# EAGLE design distortion-noise-and-ring-modulator-v1.1 (EAGLE 9.6.2)

## Sheet 1 of 3: Ring modulator
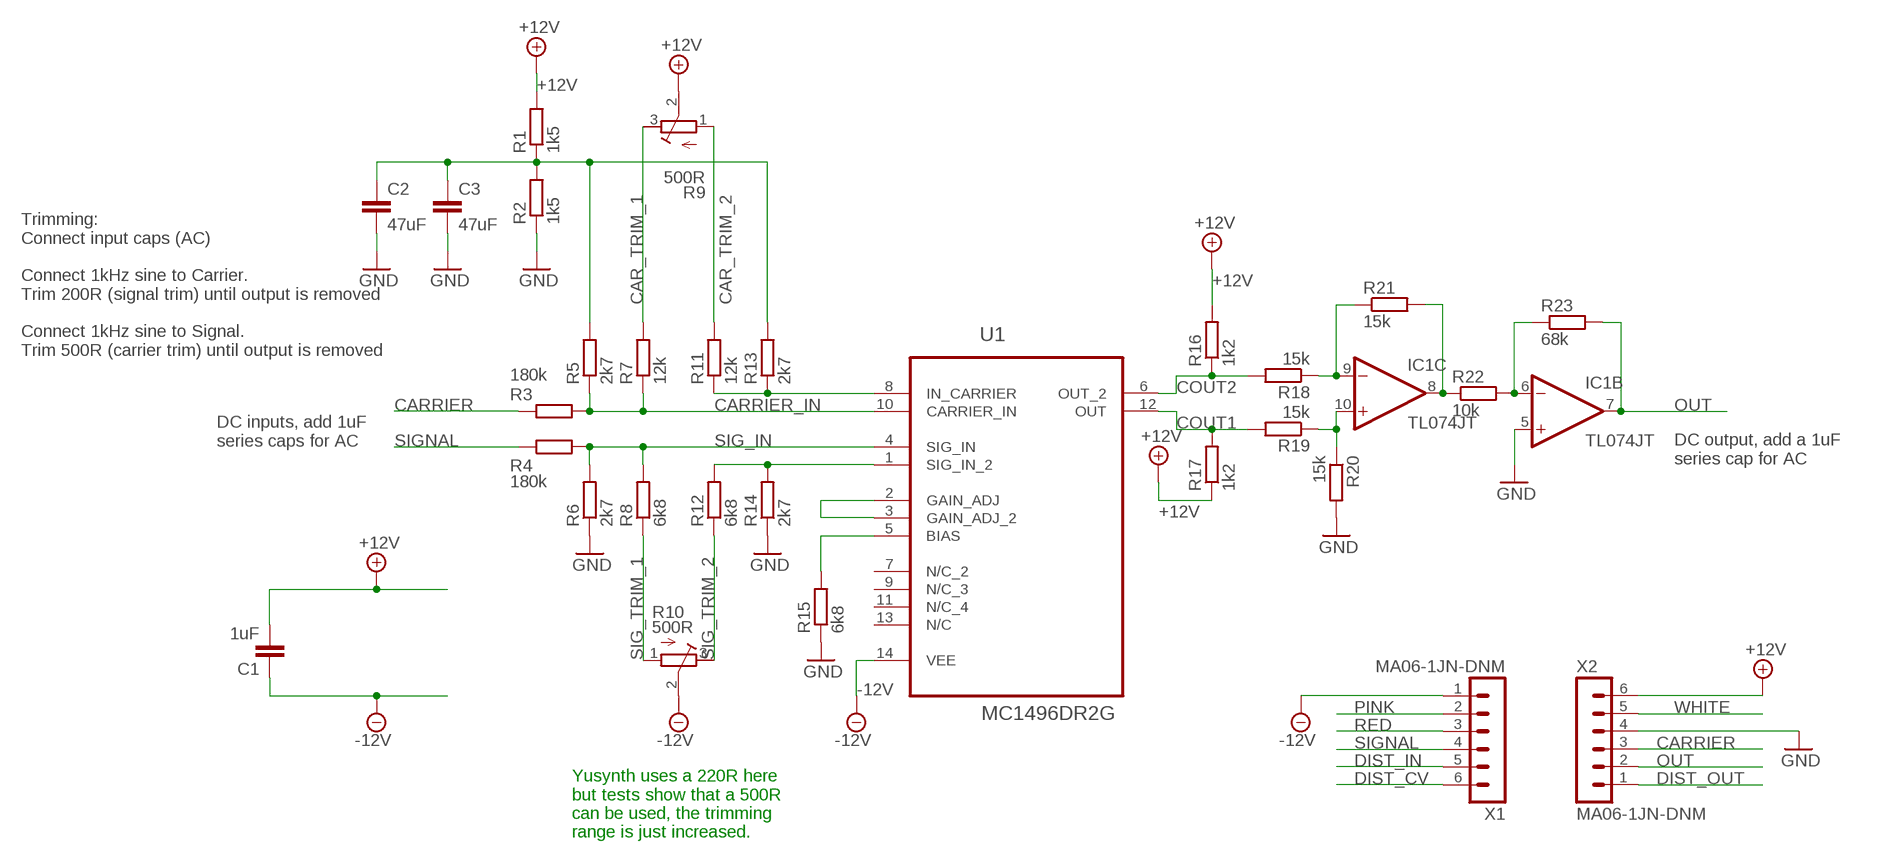
[diagram p0: schematic, sheet 1]

### Parts
C1  1uF  C-EU-J0402  [C0402-J]
C2  47uF  C-EUC1206  [C1206]
C3  47uF  C-EUC1206  [C1206]
IC1  TL074JT  [TSSOP14J]
R1  1k5  R-EU_R0402  [R0402]
R2  1k5  R-EU_R0402  [R0402]
R3  180k  R-EU_R0402  [R0402]
R4  180k  R-EU_R0402  [R0402]
R5  2k7  R-EU_R0603  [R0603]
R6  2k7  R-EU_R0603  [R0603]
R7  12k  R-EU_R0402  [R0402]
R8  6k8  R-EU_R0603  [R0603]
R9  500R  R-TRIMM3296X  [RTRIM3296X]
R10  500R  R-TRIMM3296X  [RTRIM3296X]
R11  12k  R-EU_R0402  [R0402]
R12  6k8  R-EU_R0603  [R0603]
R13  2k7  R-EU_R0603  [R0603]
R14  2k7  R-EU_R0603  [R0603]
R15  6k8  R-EU_R0603  [R0603]
R16  1k2  R-EU_R0603  [R0603]
R17  1k2  R-EU_R0603  [R0603]
R18  15k  R-EU_R0402  [R0402]
R19  15k  R-EU_R0402  [R0402]
R20  15k  R-EU_R0402  [R0402]
R21  15k  R-EU_R0402  [R0402]
R22  10k  R-EU_R0402  [R0402]
R23  68k  R-EU_R0603  [R0603]
U1  MC1496DR2G  [SOIC127P600X175-14N]
X1  MA06-1JN-DNM  MA06-1JN  [MA06N-1J]
X2  MA06-1JN-DNM  MA06-1JN  [MA06N-1J]

### Nets
+12V: C1.2 R1.2 R9.2(S) R16.2 R17.1 X2.6 ; also sheet 2,3
-12V: C1.1 R10.2(S) U1.14(VEE) X1.1 ; also sheet 2,3
CAR_TRIM_1: R7.2 R9.3(E)
CAR_TRIM_2: R9.1(A) R11.2
CARRIER: R3.1 X2.3
CARRIER_IN: R3.2 R5.1 R7.1 U1.10(CARRIER_IN)
COUT1: R17.2 R19.2 U1.12(OUT)
COUT2: R16.1 R18.2 U1.6(OUT_2)
DIST_CV: X1.6 ; also sheet 3
DIST_IN: X1.5 ; also sheet 3
DIST_OUT: X2.1 ; also sheet 3
GND: C2.2 C3.2 IC1.5(B:+IN) R2.1 R6.1 R14.1 R15.1 R20.2 X2.4 ; also sheet 2,3
N$3: R12.2 R14.2 U1.1(SIG_IN_2)
N$8: R11.1 R13.1 U1.8(IN_CARRIER)
N$9: C2.1 C3.1 R1.1 R2.2 R5.2 R13.2
N$11: R15.2 U1.5(BIAS)
N$12: U1.2(GAIN_ADJ) U1.3(GAIN_ADJ_2)
N$15: IC1.10(C:+IN) R19.1 R20.1
N$16: IC1.9(C:-IN) R18.1 R21.1
N$17: IC1.8(C:OUT) R21.2 R22.1
N$18: IC1.6(B:-IN) R22.2 R23.1
OUT: IC1.7(B:OUT) R23.2 X2.2
PINK: X1.2 ; also sheet 2
RED: X1.3 ; also sheet 2
SIG_IN: R4.2 R6.2 R8.2 U1.4(SIG_IN)
SIG_TRIM_1: R8.1 R10.1(A)
SIG_TRIM_2: R10.3(E) R12.1
SIGNAL: R4.1 X1.4
WHITE: X2.5 ; also sheet 2
Unconnected: U1.7(N/C_2) U1.9(N/C_3) U1.11(N/C_4) U1.13(N/C)

### Notes on the sheet
- Trimming:
  Connect input caps (AC)
  
  Connect 1kHz sine to Carrier. 
  Trim 200R (signal trim) until output is removed
  
  Connect 1kHz sine to Signal. 
  Trim 500R (carrier trim) until output is removed
- DC inputs, add 1uF 
  series caps for AC
- DC output, add a 1uF 
  series cap for AC
- Yusynth uses a 220R here
  but tests show that a 500R
  can be used, the trimming
  range is just increased.

## Sheet 2 of 3: Noise
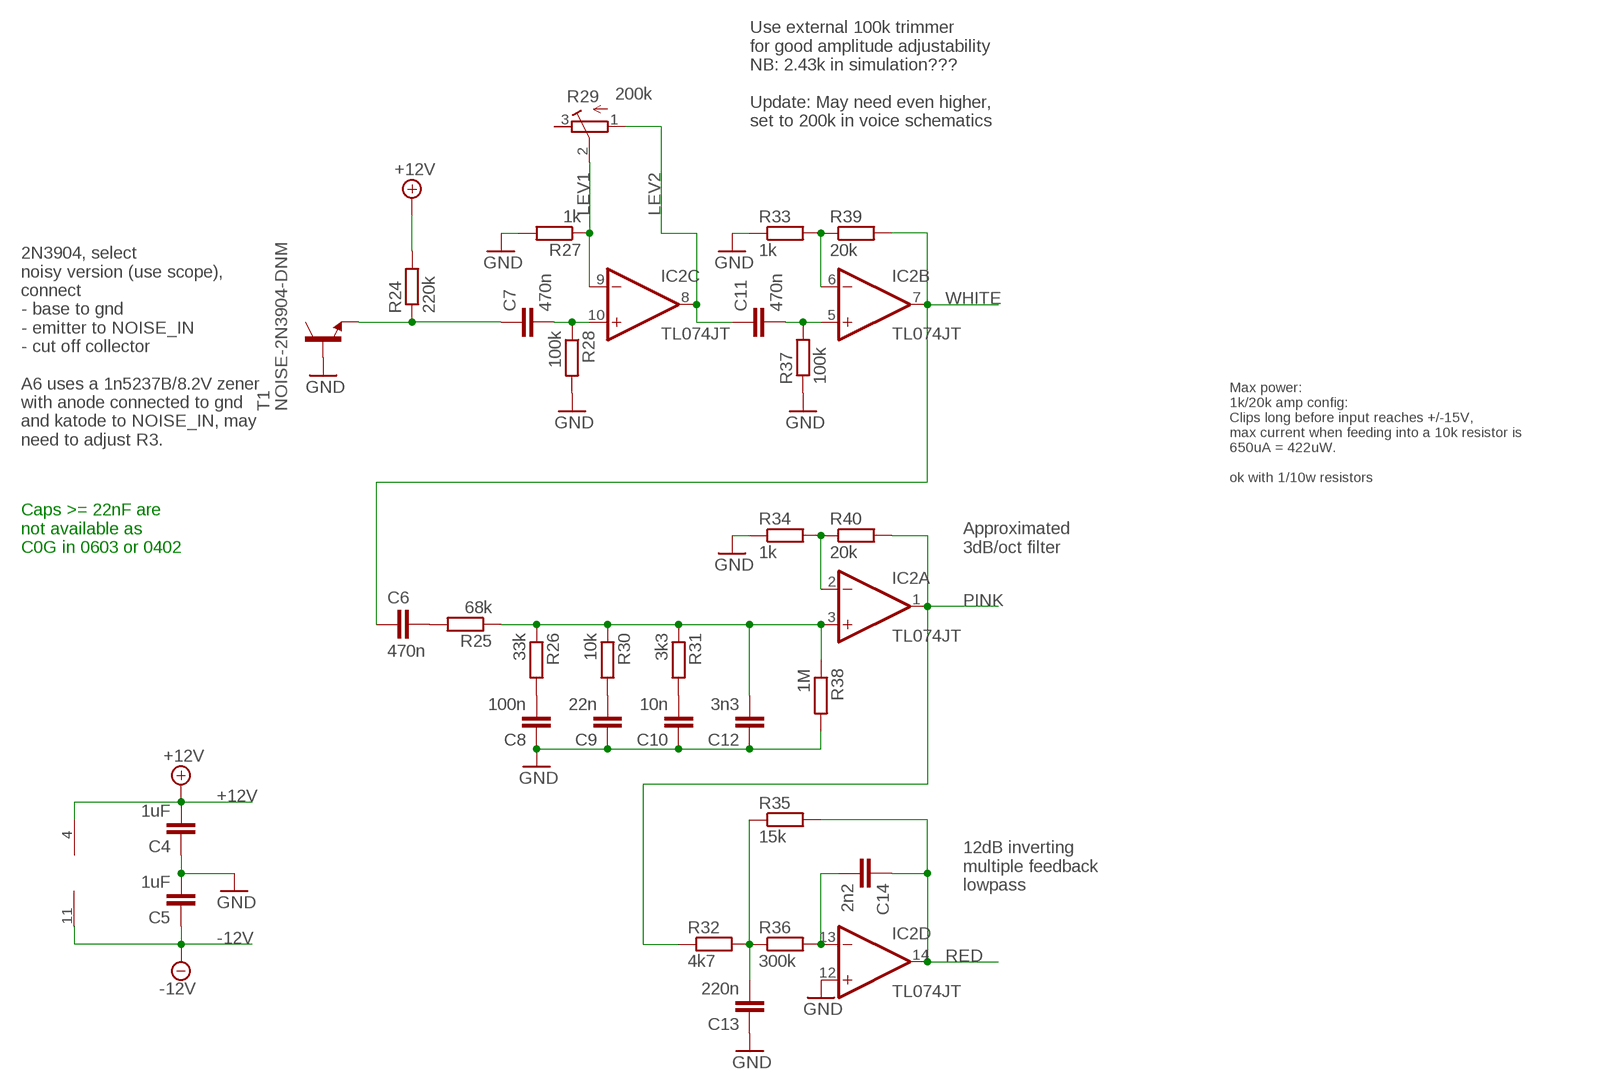
[diagram p1: schematic, sheet 2]

### Parts
C4  1uF  C-EU-J0402  [C0402-J]
C5  1uF  C-EU-J0402  [C0402-J]
C6  470n  C-EU-J0603  [C0603-J]
C7  470n  C-EU-J0603  [C0603-J]
C8  100n  C-EU-J0402  [C0402-J]
C9  22n  C-EU-J0402  [C0402-J]
C10  10n  C-EU-J0402  [C0402-J]
C11  470n  C-EU-J0603  [C0603-J]
C12  3n3  C-EU-J0603  [C0603-J]
C13  220n  C-EU-J0402  [C0402-J]
C14  2n2  C-EU-J0603  [C0603-J]
IC2  TL074JT  [TSSOP14J]
R24  220k  R-EU_R0603  [R0603]
R25  68k  R-EU_R0603  [R0603]
R26  33k  R-EU_R0402  [R0402]
R27  1k  R-EU_R0402  [R0402]
R28  100k  R-EU_R0402  [R0402]
R29  200k  R-TRIMM3296W  [RTRIM3296W]
R30  10k  R-EU_R0402  [R0402]
R31  3k3  R-EU_R0402  [R0402]
R32  4k7  R-EU_R0402  [R0402]
R33  1k  R-EU_R0402  [R0402]
R34  1k  R-EU_R0402  [R0402]
R35  15k  R-EU_R0402  [R0402]
R36  300k  R-EU_R0603  [R0603]
R37  100k  R-EU_R0402  [R0402]
R38  1M  R-EU_R0402  [R0402]
R39  20k  R-EU_R0402  [R0402]
R40  20k  R-EU_R0402  [R0402]
T1  NOISE-2N3904-DNM  NOISE-2N3904  [NOISE-2N3904-J]

### Nets
+12V: C4.2 IC2.4(P:V+) R24.2 ; also sheet 1,3
-12V: C5.1 IC2.11(P:V-) ; also sheet 1,3
GND: C4.1 C5.2 C8.1 C9.1 C10.1 C12.1 C13.1 IC2.12(D:+IN) R27.2 R28.2 R33.1 R34.1 R37.1 R38.2 T1.B ; also sheet 1,3
LEV1: IC2.9(C:-IN) R27.1 R29.2(S)
LEV2: C11.1 IC2.8(C:OUT) R29.1(A)
N$1: IC2.2(A:-IN) R34.2 R40.1
N$2: IC2.6(B:-IN) R33.2 R39.1
N$4: C8.2 R26.2
N$5: C9.2 R30.2
N$6: C10.2 R31.2
N$7: C7.1 R24.1 T1.E
N$10: C7.2 IC2.10(C:+IN) R28.1
N$13: C11.2 IC2.5(B:+IN) R37.2
N$14: C12.2 IC2.3(A:+IN) R25.1 R26.1 R30.1 R31.1 R38.1
N$19: C6.2 R25.2
N$20: C13.2 R32.2 R35.1 R36.1
N$21: C14.2 IC2.13(D:-IN) R36.2
PINK: IC2.1(A:OUT) R32.1 R40.2 ; also sheet 1
RED: C14.1 IC2.14(D:OUT) R35.2 ; also sheet 1
WHITE: C6.1 IC2.7(B:OUT) R39.2 ; also sheet 1
Unconnected: R29.3(E)

### Notes on the sheet
- Use external 100k trimmer 
  for good amplitude adjustability
  NB: 2.43k in simulation???
  
  Update: May need even higher, 
  set to 200k in voice schematics
- 2N3904, select
  noisy version (use scope),
  connect 
  - base to gnd
  - emitter to NOISE_IN
  - cut off collector
  
  A6 uses a 1n5237B/8.2V zener
  with anode connected to gnd 
  and katode to NOISE_IN, may
  need to adjust R3.
- Max power:
  1k/20k amp config:
  Clips long before input reaches +/-15V,
  max current when feeding into a 10k resistor is
  650uA = 422uW. 
  
  ok with 1/10w resistors
- Caps >= 22nF are
  not available as 
  C0G in 0603 or 0402
- Approximated
  3dB/oct filter
- 12dB inverting
  multiple feedback
  lowpass

## Sheet 3 of 3: Distortion
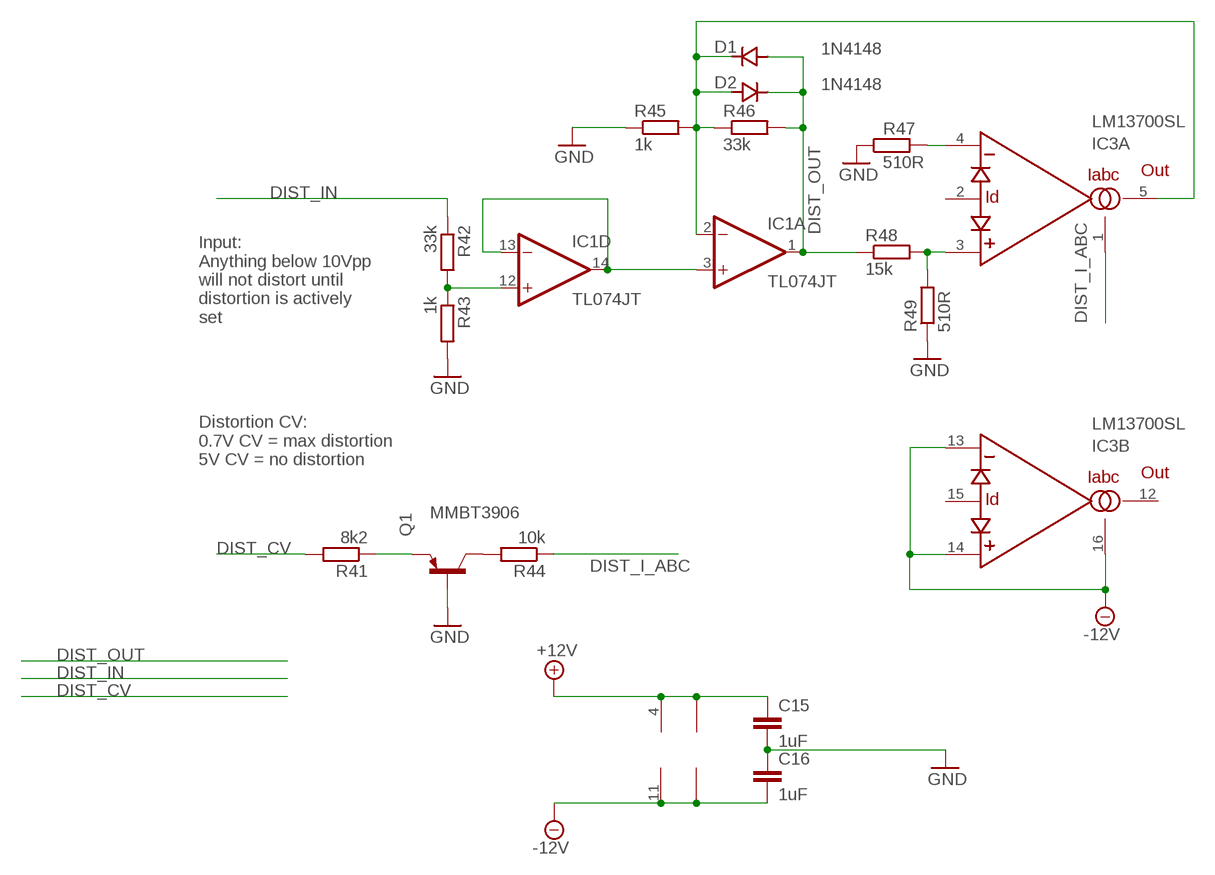
[diagram p2: schematic, sheet 3]

### Parts
C15  1uF  C-EU-J0402  [C0402-J]
C16  1uF  C-EU-J0402  [C0402-J]
D1  1N4148  1N4148SOD323  [SOD323J]
D2  1N4148  1N4148SOD323  [SOD323J]
IC3  LM13700SL  [SO16-NARROW-J]
Q1  MMBT3906  MMBT3906LT1SMD  [SOT23-BEC]
R41  8k2  R-EU_R0603  [R0603]
R42  33k  R-EU_R0402  [R0402]
R43  1k  R-EU_R0402  [R0402]
R44  10k  R-EU_R0402  [R0402]
R45  1k  R-EU_R0402  [R0402]
R46  33k  R-EU_R0402  [R0402]
R47  510R  R-EU_R0402  [R0402]
R48  15k  R-EU_R0402  [R0402]
R49  510R  R-EU_R0402  [R0402]

### Nets
+12V: C15.1 IC1.4(P:V+) IC3.11(V+) ; also sheet 1,2
-12V: C16.2 IC1.11(P:V-) IC3.6(V-) IC3.13(B:-IN) IC3.14(B:+IN) IC3.16(B:IABC) ; also sheet 1,2
DIST_CV: R41.2 ; also sheet 1
DIST_I_ABC: IC3.1(A:IABC) R44.1
DIST_IN: R42.1 ; also sheet 1
DIST_OUT: D1.2(A) D2.1(C) IC1.1(A:OUT) R46.2 R48.1 ; also sheet 1
GND: C15.2 C16.1 Q1.B R43.2 R45.1 R47.1 R49.1 ; also sheet 1,2
N$22: IC1.12(D:+IN) R42.2 R43.1
N$23: IC1.3(A:+IN) IC1.13(D:-IN) IC1.14(D:OUT)
N$24: D1.1(C) D2.2(A) IC1.2(A:-IN) IC3.5(A:OUT) R45.2 R46.1
N$25: IC3.4(A:-IN) R47.2
N$26: IC3.3(A:+IN) R48.2 R49.2
N$27: Q1.E R41.1
N$28: Q1.C R44.2
Unconnected: IC3.2(A:ID) IC3.7(IN) IC3.8(OUT) IC3.9(OUT) IC3.10(IN) IC3.12(B:OUT) IC3.15(B:ID)

### Notes on the sheet
- Input:
  Anything below 10Vpp
  will not distort until
  distortion is actively
  set
- Distortion CV:
  0.7V CV = max distortion
  5V CV = no distortion

## Library data of the parts
C1 C4-C16 = joakim:C-EU-J: CAPACITOR, European symbol
C2 C3 = rcl:C-EU: CAPACITOR, European symbol; SPICEPREFIX: C
D1 D2 = joakim:1N4148: DIODE high speed (Philips)
IC1 IC2 = joakim:TL074J: OP AMP
IC3 = joakim:LM13700: National Dual OTA with buffers.
Q1 = transistor-pnp:MMBT3906*: PNP Transistror
R1-R8 R11-R28 R30-R49 = rcl:R-EU_: RESISTOR, European symbol; SPICEPREFIX: R
R9 R10 R29 = rcl:R-TRIMM: Trimm resistor; SPICEMODEL: X; SPICEPREFIXL: POT
T1 = joakim:NOISE-2N3904: 2N3904 with the collector cut, used as a noise source
U1 = ON Semiconductor_By_element14_Batch_1:MC1496DR2G: Balanced Modulators/Demodulators; MPN: MC1496DR2G; OC_FARNELL: 1651904; OC_NEWARK: 45J1148; PACKAGE: SOIC-14; SUPPLIER: ON SEMICONDUCTOR
X1 X2 = joakim:MA06-1J

## Board
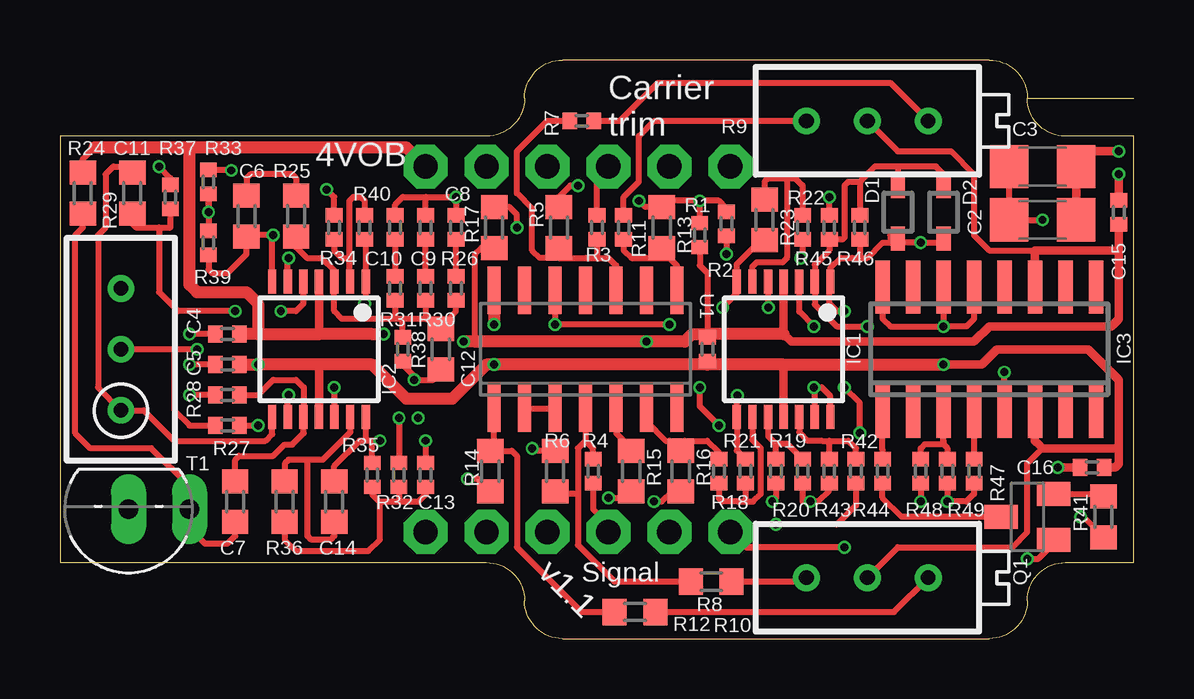
[diagram p3: board, top side]
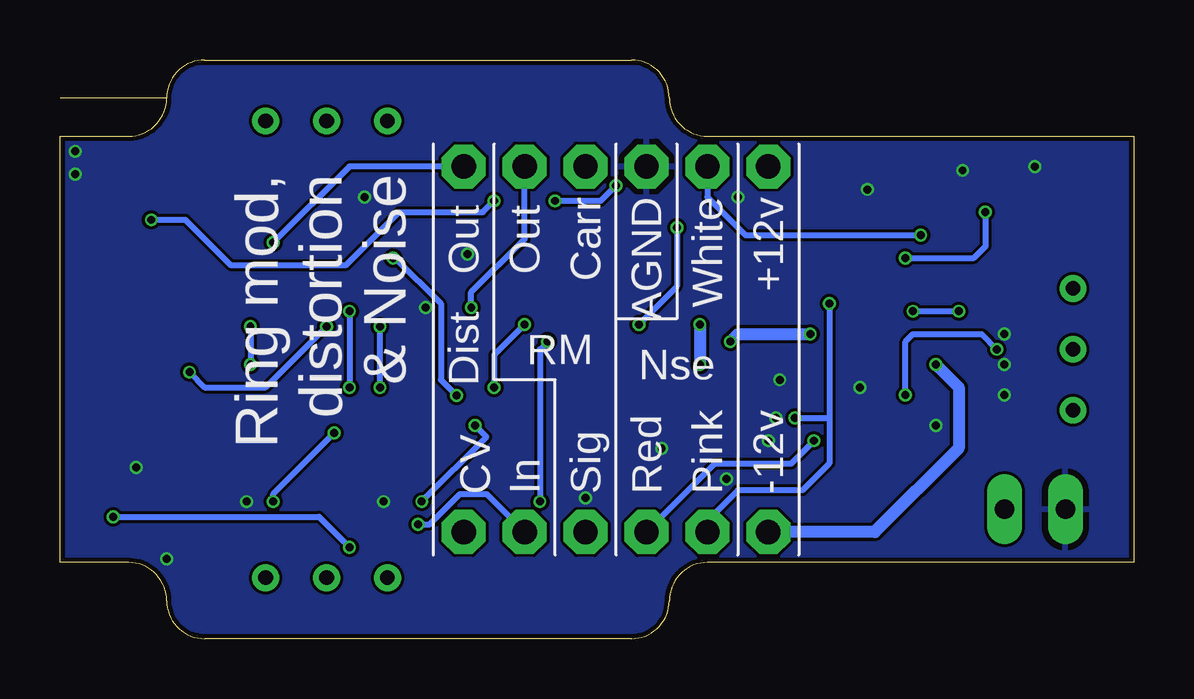
[diagram p4: board, bottom side, seen from below]

Size 44.77 x 24.13 mm. Coordinates in mm from the lower left corner, seen from the top.
Outline: 40.32,22.54 arc90 38.73,24.13 20.95,24.13 arc90 19.37,22.54 arc-90 17.78,20.96 0,20.96 0,4.45 0,3.17 17.78,3.17 arc-90 19.37,1.59 arc90 20.95,0 38.73,0 arc90 40.32,1.59 arc-90 41.91,3.17 44.77,3.17 44.77,20.96 41.91,20.96 arc-90 40.32,22.54
Outline: 40.32,22.54 44.77,22.54
Copper layers (1*16): Top 0.035mm / dielectric 1.6mm / Bottom 0.035mm
Design rules "jlcpcb-2layers *": minimum track width 5mil, minimum drill 0.3mm, track to track 5mil, track to pad 5mil, pad to pad 5mil, via to via 5mil, smd to smd 5mil, copper to edge 0.2mm, drill to drill 6mil, minimum pad ring 10mil, minimum via ring 4mil, stop-mask expansion 4mil, vias tented up to drill 0mil, thermal gap 10mil

### Footprints (pad centres in the part's own frame; a part is rotated, then mirrored left to right if it is on the bottom)
C0402-J = smd 0.6 x 0.7: 1 -0.5,0; 2 0.5,0
C1206 = smd 1.6 x 1.8: 1 -1.4,0; 2 1.4,0
C0603-J = smd 1 x 1.1: 1 -0.85,0; 2 0.85,0
SOD323J = smd 1 x 0.6: 1 -1.1,0; 2 1.1,0
TSSOP14J = smd 0.35 x 1: 1 -1.95,-2.825; 2 -1.3,-2.825; 3 -0.65,-2.825; 4 0,-2.825; 5 0.65,-2.825; 6 1.3,-2.825; 7 1.95,-2.825; 8 1.95,2.825; 9 1.3,2.825; 10 0.65,2.825; 11 0,2.825; 12 -0.65,2.825; 13 -1.3,2.825; 14 -1.95,2.825
SO16-NARROW-J = smd 0.6 x 2.2: 1 -4.445,-2.6; 2 -3.175,-2.6; 3 -1.905,-2.6; 4 -0.635,-2.6; 5 0.635,-2.6; 6 1.905,-2.6; 7 3.175,-2.6; 8 4.445,-2.6; 9 4.445,2.6; 10 3.175,2.6; 11 1.905,2.6; 12 0.635,2.6; 13 -0.635,2.6; 14 -1.905,2.6; 15 -3.175,2.6; 16 -4.445,2.6
SOT23-BEC = smd 1 x 1.4: B -0.95,-1.1; C 0,1.1; E 0.95,-1.1
R0402 = smd 0.6 x 0.7: 1 -0.5,0; 2 0.5,0
R0603 = smd 1 x 1.1: 1 -0.85,0; 2 0.85,0
RTRIM3296X = drill 0.61: 1 0,-2.54; 2 0,0; 3 0,2.54
RTRIM3296W = drill 0.61: 1 0,-2.54; 2 0,0; 3 0,2.54
NOISE-2N3904-J = drill 0.813 long: B 0,0; E -2.54,0
SOIC127P600X175-14N = smd 1.981 x 0.533: 1 -2.464,3.81; 2 -2.464,2.54; 3 -2.464,1.27; 4 -2.464,0; 5 -2.464,-1.27; 6 -2.464,-2.54; 7 -2.464,-3.81; 8 2.464,-3.81; 9 2.464,-2.54; 10 2.464,-1.27; 11 2.464,0; 12 2.464,1.27; 13 2.464,2.54; 14 2.464,3.81
MA06N-1J = drill 1.016 octagon: 1 -6.35,0; 2 -3.81,0; 3 -1.27,0; 4 1.27,0; 5 3.81,0; 6 6.35,0

### Placement (x,y rotation side)
C1  26.99,12.06 90 top
C2  40.96,17.46 0 top
C3  40.96,19.69 0 top
C4  6.99,12.7 0 top
C5  6.99,11.43 180 top
C6  7.78,17.62 90 top
C7  7.3,5.71 90 top
C8  16.51,17.15 270 top
C9  15.24,17.15 270 top
C10  13.97,17.15 270 top
C11  3.02,18.57 270 top
C12  15.88,12.06 90 top
C13  15.24,6.83 270 top
C14  11.43,5.71 270 top
C15  44.13,17.78 90 top
C16  43.02,7.14 0 top
D1  34.92,17.78 270 top
D2  36.83,17.78 90 top
IC1  30.16,12.06 180 top
IC2  10.79,12.06 180 top
IC3  38.73,12.06 0 top
Q1  40.32,5.08 90 top
R1  26.67,16.83 270 top
R2  27.78,17.3 90 top
R3  22.38,17.15 270 top
R4  22.23,6.98 90 top
R5  20.8,17.15 90 top
R6  20.64,6.98 270 top
R7  21.75,21.59 0 top
R8  27.15,2.38 180 top
R9  33.66,21.59 270 top
R10  33.66,2.54 270 top
R11  23.5,17.15 90 top
R12  23.97,1.11 180 top
R13  25.08,17.15 90 top
R14  17.94,6.98 90 top
R15  23.81,6.98 90 top
R16  25.88,6.98 270 top
R17  18.1,17.15 90 top
R18  27.46,6.98 90 top
R19  29.84,6.98 270 top
R20  30.96,6.98 270 top
R21  28.57,6.98 90 top
R22  30.96,17.15 90 top
R23  29.37,17.46 270 top
R24  0.95,18.57 90 top
R25  9.84,17.62 90 top
R26  16.51,14.61 90 top
R27  6.99,8.89 0 top
R28  6.99,10.16 180 top
R29  2.54,12.06 0 top
R30  15.24,14.61 90 top
R31  13.97,14.61 90 top
R32  14.13,6.83 270 top
R33  6.19,19.05 270 top
R34  11.43,17.15 270 top
R35  13.02,6.83 90 top
R36  9.37,5.71 90 top
R37  4.6,18.42 270 top
R38  14.29,12.06 270 top
R39  6.19,16.51 270 top
R40  12.7,17.15 270 top
R41  43.5,5.08 270 top
R42  33.18,6.98 90 top
R43  32.07,6.98 270 top
R44  34.29,6.98 270 top
R45  32.07,17.15 270 top
R46  33.34,17.15 270 top
R47  38.1,6.98 90 top
R48  35.88,6.98 90 top
R49  36.99,6.98 90 top
T1  2.86,5.4 180 top
U1  21.91,12.06 90 top
X1  21.59,4.45 0 top
X2  21.59,19.69 180 top

### Tracks (layer width: path | path; a pad name or v marks a point on that pad's centre or on a via)
+12V  (via drill 0.33)
  Top 0.254: R1.2 26.67,15.56 26.99,15.24 26.99,12.7 | R24.2 0.95,20 1.43,20.48 | R16.2 25.5,6.13 25.08,5.71 v24.77,5.71 | 17.3,12.38 17.3,16.03 17.57,16.3 R17.1 | R9.2 34.92,20.32 37.15,20.32 38.1,19.37 38.1,16.83 38.73,16.19 40.64,16.19
  Top 0.356: IC2.4 10.79,12.7 | 44.13,16.19 44.13,16.69 C15.1 | 44.13,16.19 43.18,16.19 40.64,16.19 IC3.11 | 44.13,16.19 44.13,13.33 43.81,13.02 38.73,13.02 38.1,12.38 30.48,12.38 30.16,12.7 IC1.4
  Top 0.508: 26.99,12.7 26.35,12.7 26.04,12.38 v24.45,12.38 17.46,12.38 17.3,12.38 v16.83,12.38 | C1.2 26.99,12.7 | 8.26,12.7 C4.2 | v13.49,12.7 13.02,12.7 10.79,12.7 8.26,12.7 | 8.26,12.7 8.26,13.97 7.78,14.45 5.71,14.45 5.4,14.76 5.4,16.19 5.4,20.48 | 30.16,12.7 26.99,12.7 | 5.4,20.48 14.45,20.48 X2.6 | 5.4,20.48 1.43,20.48
  Bottom 0.254: v24.77,5.71 24.77,12.06 v24.45,12.38
  Bottom 0.508: v16.83,12.38 16.51,12.7 v13.49,12.7
-12V  (via drill 0.33)
  Top 0.254: IC3.14 v36.83,13.02 | IC3.16 34.29,13.33 34.61,13.02 v36.83,13.02 | IC3.13 38.1,13.33 37.78,13.02 v36.83,13.02 | R10.2 34.92,3.81 39.69,3.81 40.32,4.45 40.32,7.3 40.96,7.94
  Top 0.356: IC2.11 10.79,11.43 | C16.2 44,7.14 44.13,7.28 44.13,7.94 | 44.13,7.94 44.13,10.79 42.86,12.06 39.05,12.06 38.42,11.43 v36.83,11.43 | IC3.6 40.64,8.26 40.8,8.1 40.96,7.94 44.13,7.94 | IC1.11 30.16,11.43
  Top 0.508: U1.14 v18.1,13.1 | 26.99,11.43 30.16,11.43 v36.83,11.43 | 26.99,11.43 v18.1,11.43 17.78,11.43 16.35,10 14.45,10 13.02,11.43 10.79,11.43 v8.26,11.43 C5.1 | C1.1 26.99,11.43
  Bottom 0.254: v36.83,13.02 v36.83,11.43
  Bottom 0.508: v18.1,13.1 v18.1,11.43 | v8.26,11.43 7.3,10.48 7.3,7.94 10.79,4.45 X1.1
CAR_TRIM_1
  Top 0.254: R9.3 34.61,23.18 24.92,23.18 23.34,21.59 R7.2
CAR_TRIM_2
  Top 0.254: R9.1 24.77,21.59 24.13,20.96 24.13,19.05 23.5,18.42 R11.2
CARRIER
  Top 0.254: X2.3 22.38,19.69 R3.1
CARRIER_IN
  Top 0.254: 21.11,15.88 20.95,15.88 20,15.88 19.68,16.19 19.68,17.94 19.05,18.57 19.05,20.32 20.32,21.59 R7.1 | 21.11,15.88 22.38,15.88 R3.2 | 21.11,15.88 21.91,15.88 | 21.91,15.88 20.8,15.88 R5.1 | 21.91,15.88 22.07,15.88 22.23,15.88 22.86,15.88 23.18,15.56 U1.10
COUT1  (via drill 0.33)
  Top 0.254: v29.69,5.71 29.84,5.87 R19.2 | v27.46,8.89 26.67,9.68 v26.67,10.48 | v19.05,17.15 19.05,17.68 18.73,18 R17.2 | U1.12 v20.64,13.1 v25.4,13.1
  Bottom 0.254: v29.69,5.71 26.99,8.41 v27.46,8.89 | v19.05,17.15 19.05,14.68 v20.64,13.1 | v25.4,13.1 26.67,11.83 v26.67,10.48
COUT2
  Top 0.254: U1.6 24.45,9.05 25.24,8.26 25.4,8.26 | R18.2 27.46,7.78 26.99,8.26 25.4,8.26 | 25.4,8.26 26.04,8.26 25.88,8.1 R16.1
DIST_CV  (via drill 0.33)
  Top 0.254: R41.2 42.65,5.08 v42.55,5.08 | v32.7,3.81 28.89,3.81 | 28.89,3.81 28.57,3.81 | X1.6 28.57,3.81 | 28.57,3.81 28.89,3.81
  Bottom 0.254: v42.55,5.08 33.97,5.08 v32.7,3.81
DIST_I_ABC
  Top 0.254: R44.1 34.29,7.88 IC3.1
DIST_IN  (via drill 0.33)
  Top 0.254: R42.1 33.18,5.56 32.38,4.76 v29.84,4.76
  Bottom 0.254: v29.84,4.76 29.37,4.76 28.1,6.03 26.99,6.03 X1.5
DIST_OUT  (via drill 0.33)
  Top 0.254: R46.2 33.34,15.88 | D1.2 34.76,16.68 34.61,16.83 34.61,16.51 | 34.61,16.51 34.29,16.51 33.66,15.88 33.34,15.88 | 34.61,16.51 v35.88,16.51 36.83,16.51 D2.1 | 33.34,15.88 33.02,15.88 32.54,15.88 32.11,15.44 IC1.1 32.07,14.85 32.07,13.97 32.38,13.65 v32.7,13.65 | R48.1 v35.88,5.71 | v33.34,8.57 33.34,9.84 v32.7,10.48
  Bottom 0.254: v35.88,5.71 35.88,6.03 v33.34,8.57 | v35.88,16.51 32.7,19.69 X2.1 | v32.7,13.65 v32.7,10.48
GND  (via drill 0.33)
  Top 0.254: v22.86,5.87 23.84,5.87 24.1,6.13 R15.1 | R2.1 v27.78,16.03 | R20.2 30.96,5.71 v31.27,5.71 31.59,5.71 32.07,6.19 R43.2 | IC2.12 11.45,10.46 v11.43,10.48 | R38.2 14.29,11.43 14.76,10.95 v14.76,10.79 15.56,10.79 15.88,11.11 C12.1 | v4.13,19.69 4.6,19.21 R37.1 | C4.1 v5.4,12.7 | C5.2 v5.4,11.43 | R28.2 v5.4,10.16 | v15.24,8.26 C13.1 | R27.2 v8.26,8.89 | IC1.5 29.51,13.83 v29.53,13.81 | R45.1 v32.07,18.42 | R49.1 v36.99,5.71 37.78,5.71 38.1,6.03 R47.1 | Q1.B 41.42,3.97 40.78,3.33 v40.32,3.33 | R34.1 11.43,18.42 v11.11,18.73 | C10.1 13.97,18.1 14.29,18.42 15.24,18.42 | 15.24,18.42 16.19,18.42 v16.51,18.42 C8.1 | C9.1 15.24,18.42 | R33.1 6.21,19.53 v7.14,19.53 | R6.1 19.79,7.83 v19.68,7.94 | R14.1 17.41,6.67 v16.99,6.67
  Top 0.356: C16.1 v41.59,7.14 | C15.2 v44.13,19.37 | C2.2 C3.2 42.99,20.32 v44.13,20.32
  other vias: 14.92,9.21
  pour Bottom: -0.64,25.08 45.4,25.08 45.4,-0.64 -0.64,-0.64
LEV1  (via drill 0.33)
  Top 0.254: IC2.9 9.49,10.13 v9.53,10.16 | v5.71,12.06 4.76,12.06 | 4.76,12.06 R29.2 | R27.1 5.4,8.89 4.76,9.53 4.76,12.06
  Bottom 0.254: v9.53,10.16 9.53,12.38 9.21,12.7 6.35,12.7 v5.71,12.06
LEV2
  Top 0.254: C11.1 2.8,19.42 2.54,19.69 2.22,19.69 1.91,19.37 1.91,17.15 1.59,16.83 1.59,10.48 R29.1 3.49,9.53 4.76,8.26 8.57,8.26 8.85,8.53 IC2.8
N$1
  Top 0.254: IC2.2 12.06,14.92 12.06,15.88 | R34.2 11.43,16.19 11.75,15.88 12.06,15.88 | 12.06,15.88 12.06,18.26 12.22,18.42 12.54,18.42 12.7,18.26 R40.1
N$2  (via drill 0.33)
  Top 0.254: IC2.6 9.49,15.85 v9.53,15.88 | R39.1 R33.2 v6.19,17.78
  Bottom 0.254: v6.19,17.78 6.19,16.35 6.67,15.88 v9.53,15.88
N$3
  Top 0.254: U1.1 18.1,7.99 R14.2 18.84,7.83 19.05,7.62 19.05,3.81 21.75,1.11 R12.2
N$4
  Top 0.254: R26.2 C8.2
N$5
  Top 0.254: R30.2 C9.2
N$6
  Top 0.254: C10.2 R31.2
N$7
  Top 0.254: R24.1 0.95,17.15 0.64,16.84 0.64,8.56 1.27,7.94 3.81,7.94 5.4,6.35 T1.E 5.4,4.6 6.03,3.97 6.99,3.97 7.3,4.29 C7.1
N$8
  Top 0.254: R11.1 23.5,16.19 23.81,15.88 24.45,15.88 | 24.45,15.88 25.08,15.88 R13.1 | 24.45,15.88 24.61,15.88 24.77,15.88 25.4,15.88 25.72,15.56 U1.8
N$9  (via drill 0.33)
  Top 0.254: R2.2 27.78,17.94 27.46,18.26 v26.67,18.26 | v26.67,18.26 26.51,18.26 25.4,18.26 25.24,18.1 25.18,18.1 R13.2 24.39,18 v24.13,18.26 | v21.59,18.89 21.27,18.89 20.8,18.42 R5.2 | v40.96,17.46 C2.1 C3.1 | R1.1 v26.67,18.26
  Bottom 0.254: v24.13,18.26 22.23,18.26 v21.59,18.89 | v26.67,18.26 27.15,17.78 30.64,17.78 32.87,15.56 37.63,15.56 39.53,17.46 v40.96,17.46
N$10
  Top 0.254: R28.1 8.26,10.16 8.89,10.79 9.84,10.79 10.16,10.48 10.16,9.25 | 10.16,9.25 IC2.10 | 10.16,9.25 10.16,8.57 9.68,8.1 9.37,8.1 8.89,7.62 7.46,7.62 7.3,7.46 C7.2
N$11
  Top 0.254: U1.5 23.18,8.57 23.81,7.94 R15.2
N$12
  Top 0.254: U1.2 U1.3
N$13  (via drill 0.33)
  Top 0.254: C11.2 3.02,17.3 3.17,17.15 4.13,17.15 | 4.13,17.15 4.6,17.15 R37.2 | IC2.5 10.14,13.96 9.84,13.65 v9.21,13.65 | v7.3,13.65 4.92,13.65 4.13,14.45 4.13,17.15
  Bottom 0.254: v9.21,13.65 v7.3,13.65
N$14
  Top 0.254: R26.1 16.51,13.65 16.19,13.33 15.88,13.33 | R31.1 13.97,13.33 | R38.1 14.29,13.33 | C12.2 15.88,13.33 | R30.1 15.24,13.33 | 15.24,13.33 14.61,13.33 14.29,13.33 | 14.29,13.33 13.97,13.33 | 15.24,13.33 15.88,13.33 | R25.1 9.84,16.33 10.29,15.88 10.89,15.88 11.45,15.32 IC2.3 11.43,14.88 11.43,13.65 11.75,13.33 13.97,13.33
N$15
  Top 0.254: R19.1 29.84,8.12 | IC1.10 29.53,9.22 29.53,8.44 29.84,8.12 | 29.84,8.12 30.32,8.12 R20.1
N$16
  Top 0.254: R18.1 27.46,5.85 27.6,5.71 28.26,5.71 28.57,5.71 | R21.1 28.57,5.71 | 28.57,5.71 28.89,5.71 29.21,6.03 29.21,7.94 28.86,8.29 IC1.9
N$17  (via drill 0.33)
  Top 0.254: R21.2 28.21,7.85 IC1.8 28.21,10.12 v28.23,10.14 | R22.1 30.96,15.95 v30.88,15.88
  Bottom 0.254: v30.88,15.88 30.8,15.88 28.89,13.97 28.89,10.79 v28.23,10.14
N$18
  Top 0.254: IC1.6 28.86,15.51 29.05,15.7 30.13,15.7 30.32,15.89 30.32,19.21 | 30.32,19.21 29.53,19.21 29.37,19.05 R23.1 | 30.32,19.21 30.64,19.21 30.96,18.89 R22.2
N$19
  Top 0.254: R25.2 9.84,19.21 9.68,19.37 7.94,19.37 7.78,19.21 C6.2
N$20
  Top 0.254: 14.13,5.71 14.45,5.71 14.95,5.71 15.24,6.01 C13.2 | R32.2 14.13,5.71 | R35.1 13.02,6.01 13.34,5.69 | R36.1 9.37,4.13 9.84,3.65 12.86,3.65 13.34,4.13 13.34,5.69 | 13.34,5.69 13.36,5.71 14.13,5.71
N$21
  Top 0.254: IC2.13 12.1,8.6 10.95,7.46 10.32,7.46 | C14.2 11.43,4.29 11.27,4.13 10.48,4.13 10.32,4.29 10.32,7.46 | R36.2 9.37,7.3 9.53,7.46 10,7.46 10.32,7.46
N$22
  Top 0.254: IC1.12 30.81,8.61 31.16,8.26 31.75,8.26 32.07,8.26 | R42.2 33.18,7.94 32.86,8.26 32.07,8.26 | R43.1 32.07,8.26
N$23  (via drill 0.33)
  Top 0.254: IC1.14 32.11,10.12 31.75,10.48 v31.43,10.48 31.46,10.45 IC1.13 | v31.43,13.02 30.81,13.64 IC1.3
  Bottom 0.254: v31.43,10.48 v31.43,13.02
N$24  (via drill 0.33)
  Top 0.254: 33.34,19.05 R46.1 | D2.2 36.83,19.37 36.51,19.69 34.92,19.69 | 34.92,19.69 34.61,19.69 33.97,19.69 33.42,19.13 33.34,19.05 | 34.92,19.69 D1.1 | v33.66,13.02 32.38,13.02 31.46,13.94 IC1.2 31.46,15.59 32.07,16.19 R45.2 32.62,16.65 32.7,16.73 32.7,18.89 32.86,19.05 33.34,19.05 | IC3.5 v39.37,11.11
  Bottom 0.254: v33.66,13.02 36.2,10.48 38.73,10.48 v39.37,11.11
N$25
  Top 0.254: IC3.4 R47.2
N$26
  Top 0.254: 36.83,8.11 36.83,8.26 IC3.3 | R48.2 35.88,7.94 36.05,8.11 36.83,8.11 | 36.83,8.11 36.99,7.95 R49.2
N$27
  Top 0.254: Q1.E 43.05,6.03 R41.1
N$28
  Top 0.254: Q1.C 35.08,5.08 34.29,5.87 R44.2
OUT  (via drill 0.33)
  Top 0.254: IC1.7 28.21,14.4 | IC1.7 28.21,14.4 | 28.21,14.4 v27.62,13.81 | IC1.7 28.21,15.62 29.21,16.61 R23.2
  Bottom 0.254: v27.62,13.81 27.62,14.45 25.4,16.67 X2.2
PINK  (via drill 0.33)
  Top 0.254: v12.7,13.97 12.74,14.02 IC2.1 12.74,16.6 R40.2 | v14.13,9.21 R32.1
  Bottom 0.254: v12.7,13.97 12.7,9.21 | v14.13,9.21 12.7,9.21 | 12.7,9.21 12.7,7.3 13.81,6.19 16.51,6.19 17.78,4.92 X1.2
RED  (via drill 0.33)
  Top 0.254: 12.74,9.05 12.74,8.89 12.7,8.89 | 12.74,9.05 IC2.14 | C14.1 11.43,7.2 12.48,8.26 12.7,8.26 | 12.7,8.26 v13.34,8.26 13.02,8.26 R35.2 | 12.7,8.26 12.74,8.3 12.74,9.05
  Bottom 0.254: v13.34,8.26 14.29,7.3 17.46,7.3 X1.3
SIG_IN
  Top 0.254: U1.4 21.91,8.26 | 21.91,8.26 21.59,7.94 21.59,6.03 | 21.59,6.03 20.74,6.03 R6.2 | R8.2 23.11,2.38 21.59,3.9 21.59,6.03 | R4.2 22.23,7.94 21.91,8.26
SIG_TRIM_1
  Top 0.254: R8.1 30.96,2.38 R10.1
SIG_TRIM_2
  Top 0.254: R12.1 34.77,1.11 R10.3
SIGNAL
  Top 0.254: R4.1 22.23,5.4 22.86,4.76 X1.4
WHITE  (via drill 0.33)
  Top 0.254: IC2.7 8.85,16.87 v8.89,16.83 7.83,16.83 C6.1 7.78,16.03 6.99,15.24 6.35,15.24 6.19,15.4 R39.2
  Bottom 0.254: X2.5 17.78,18.42 16.19,16.83 v8.89,16.83

### Text on the board
tNames: Carrier / trim | 4VOB | v1.1 | Signal
bNames: Ring mod, / distortion / & Noise | +12v | White | AGND | Carr | Out | Out | Dist | RM | Nse | -12v | Pink | Red | Sig | In | CV